# EAGLE design zvs (EAGLE 5.07)
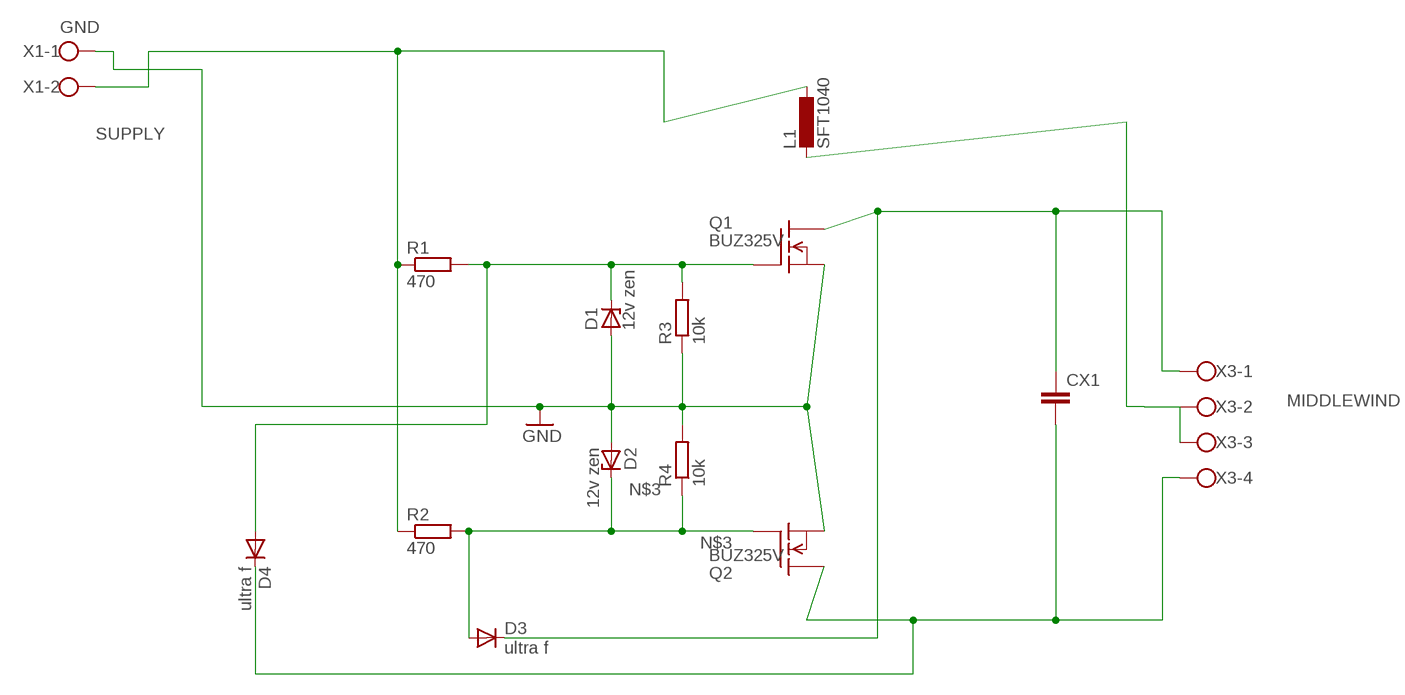
[diagram p0: schematic, sheet 1]

## Parts
CX1  C-EU375-155X418  [C375-155X418]
D1  12v zen  ZPD  [DO35Z10]
D2  12v zen  ZPD  [DO35Z10]
D3  ultra f  RGP10  [DO41-10]
D4  ultra f  RGP10  [DO41-10]
L1  SFT1040  L-EUTJ6-U2  [TJ6-U2]
Q1  BUZ325V  [TO218V]
Q2  BUZ325V  [TO218V]
R1  470  R-EU_0613/15  [P0613/15]
R2  470  R-EU_0613/15  [P0613/15]
R3  10k  R-EU_0207/10  [0207/10]
R4  10k  R-EU_0207/10  [0207/10]
X1  W237-102  [W237-102]
X3  W237-4  [W237-4]

## Nets
GND: D1.A D2.A Q1.3(S) Q2.3(S) R3.1 R4.2 X1.1
MIDDLEWIND: L1.2 X3.2 X3.3
N$3: D2.C D3.A Q2.1(G) R2.2 R4.1
N$5: CX1.2 D4.C Q2.2(D) X3.4
N$7: D1.C D4.A Q1.1(G) R1.2 R3.2
N$8: CX1.1 D3.C Q1.2(D) X3.1
SUPPLY: L1.1 R1.1 R2.1 X1.2

## Library data of the parts
CX1 = rcl:C-EU: CAPACITOR, European symbol
D1 D2 = diode:ZPD: Z DIODE 500 mW
D3 D4 = diode:RGP10: DIODE fast-recovery rectifier
L1 = rcl:L-EU: INDUCTOR, European symbol
Q1 Q2 = transistor-fet:BUZ325: N-Channel Enhancement MOSFET 400V; 10,5A; 0,5Ohm
R1 R2 = matt rcl:R-EU_: RESISTOR, European symbol
R3 R4 = resistor:R-EU_: RESISTOR, European symbol
X1 = con-wago-500:W237-102: WAGO SCREW CLAMP
X3 = con-wago-500:W237-4: WAGO SCREW CLAMP

## Board
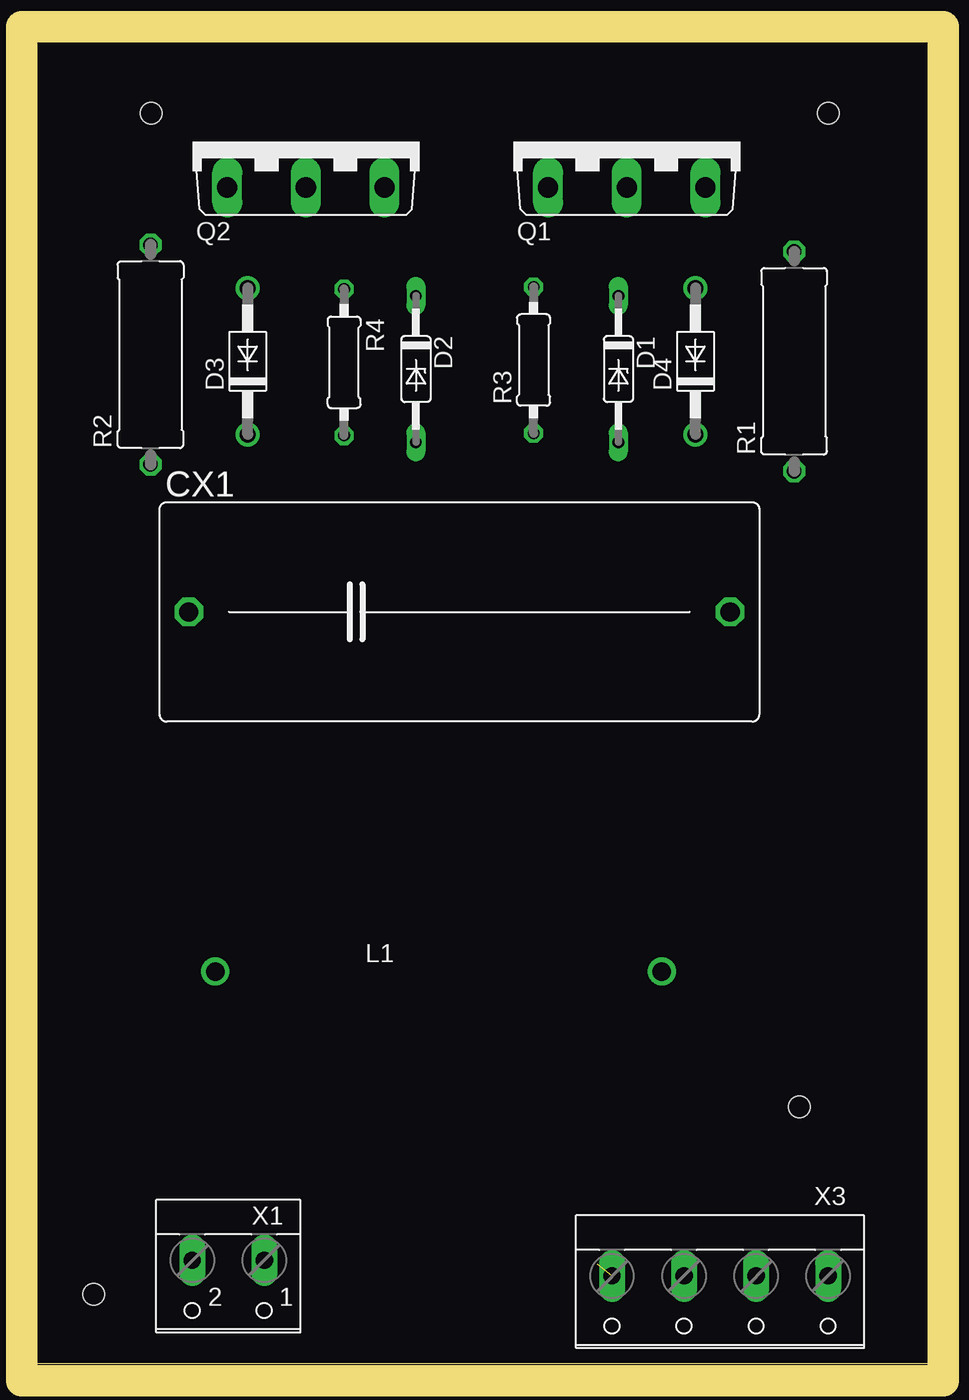
[diagram p1: board, top side]
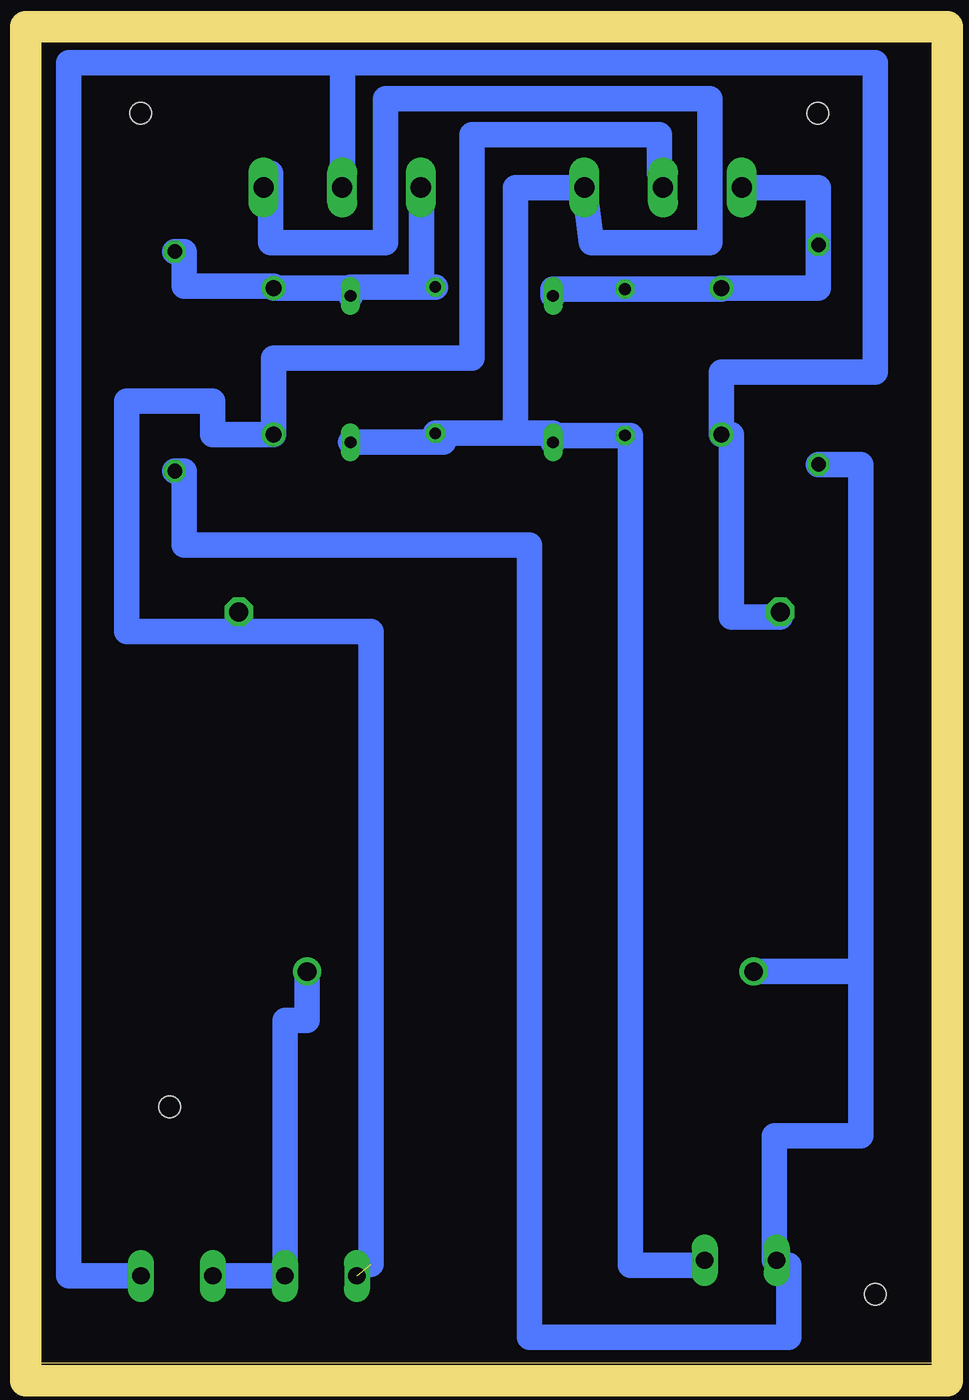
[diagram p2: board, bottom side, seen from below]

Size 62.28 x 92.16 mm. Coordinates in mm from the lower left corner, seen from the top.
Outline: 0,0 62.28,0 62.28,92.16 0,92.16 0,0
Copper layers (1*16): Top 0.035mm / dielectric 1.5mm / Bottom 0.035mm
Design rules "default": minimum track width 10mil, minimum drill 24mil, track to track 8mil, track to pad 8mil, pad to pad 8mil, via to via 8mil, smd to smd 8mil, copper to edge 40mil, drill to drill 8mil, minimum pad ring 10mil, minimum via ring 8mil, stop-mask expansion 4mil, vias tented up to drill 0mil, thermal gap 10mil
Holes 1.5 mm at 8,86.81 55,86.81 4,4.81 53,17.81
Milling: 4 lines

### Footprints (pad centres in the part's own frame; a part is rotated, then mirrored left to right if it is on the bottom)
C375-155X418 = drill 1.321 octagon: 1 -18.796,0; 2 18.796,0
DO35Z10 = drill 0.813 long: A 5.08,0; C -5.08,0
DO41-10 = drill 1.118 round: A 5.08,0; C -5.08,0
TJ6-U2 = drill 1.3 round: 1 -15.5,0; 2 15.5,0
TO218V = drill 1.397 long: 1 -5.461,-3.175; 2 0,-3.175; 3 5.461,-3.175
P0613/15 = drill 1.016 octagon: 1 -7.62,0; 2 7.62,0
0207/10 = drill 0.813 octagon: 1 -5.08,0; 2 5.08,0
W237-102 = drill 1.194 long: 1 -2.5,-1.27; 2 2.5,-1.27
W237-4 = drill 1.194 long: 1 -7.5,-1.27; 2 -2.5,-1.27; 3 2.5,-1.27; 4 7.5,-1.27

### Placement (x,y rotation side)
CX1  29.4,52.18 0 top
D1  40.44,69.04 270 top
D2  26.38,69.04 270 top
D3  14.7,69.58 90 top
D4  45.79,69.58 90 top
L1  27.95,27.21 0 top
Q1  41.02,84.82 0 top
Q2  18.74,84.82 0 top
R1  52.64,69.58 90 top
R2  7.95,70.04 90 top
R3  34.55,69.66 90 top
R4  21.39,69.51 270 top
X1  13.35,5.89 180 top
X3  47.5,4.81 180 top

### Tracks (layer width: path | path; a pad name or v marks a point on that pad's centre or on a via)
GND
  Bottom 1.778: 29,64.58 26.38,64.58 D2.A 26.38,64.43 R4.2 21,64.43 21,6.81 15.85,6.81 X1.1 | 29,64.58 34,64.58 | 34,64.58 R3.1 | 29,64.58 29,81.64 Q2.3 23.7,77.81 15.5,77.81 15.5,87.81 38,87.81 38,77.81 46,77.81 46,82.64 Q1.3 | D1.A 34,63.96 34,64.58
MIDDLEWIND
  Bottom 1.778: L1.2 43.45,23.81 45,23.81 X3.3 X3.2
N$3
  Bottom 1.778: Q2.1 7.95,81.64 R2.2 7.95,74.66 D3.A 14.7,74.59 R4.1 26.38,74.59 D2.C
N$5  (1 unrouted)
  Bottom 1.778: 39,6.87 39,50.81 48.2,50.81 | 48.2,50.81 56,50.81 56,66.81 50,66.81 50,64.5 D4.C 45.79,69.81 32,69.81 32,85.31 19,85.31 19,82.64 Q2.2 | 48.2,50.81 CX1.2
N$7
  Bottom 1.778: R3.2 35.5,74.74 | 35.5,74.74 40.44,74.74 D1.C 40.44,74.66 D4.A 45.79,74.81 52,74.81 52,77.2 R1.2 | Q1.1 35.5,82.64 35.5,74.74
N$8
  Bottom 1.778: Q1.2 41,82.64 41,90.31 | 41,90.31 4,90.31 4,68.81 14.7,68.81 D3.C 14,64.5 14,51.81 10.6,51.81 CX1.1 | 41,90.31 60,90.31 60,6.08 X3.1
SUPPLY
  Bottom 1.778: R2.1 5,62.42 5,27.21 | 5,27.21 5,15.81 11,15.81 11,7.16 X1.2 10.85,6.81 10,6.81 10,1.81 28,1.81 28,56.81 52,56.81 52,61.96 R1.1 | 5,27.21 L1.1